# Altium schematic sheet [12] - DOC REVISION HISTORY.SchDoc
size A3; CompanyName: FPT-FTI copporation; Address1: FPT Building Duy Tan; Address2: Floor 4,; DocumentNumber: 13; SheetNumber: 13; SheetTotal: 13; NameAuthor: Angle Vu
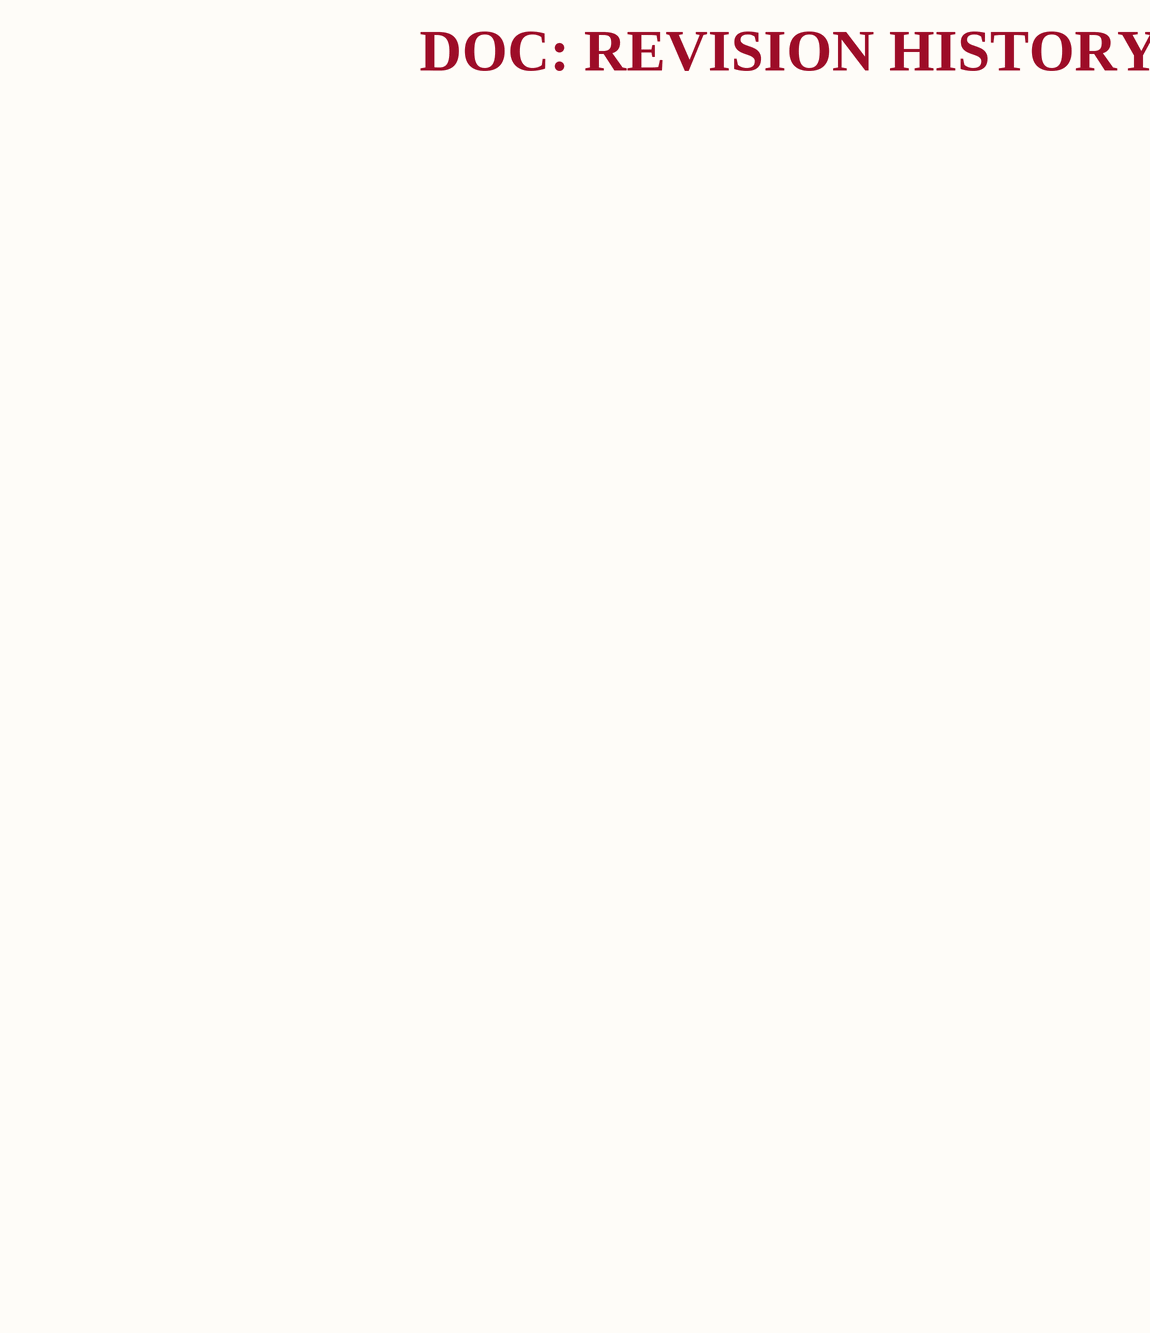
[diagram p0: [12] - DOC REVISION HISTORY.SchDoc]

## Notes on the sheet
- DOC: REVISION HISTORY
- CLOCKS (CPU & PCIE)
- Designed By
- Checked By
- Company:
- Size:
- A3
- Address:
- Sheet:
- /